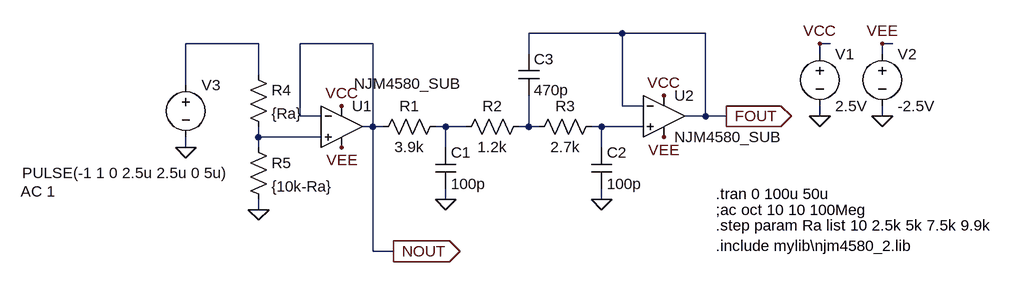
[diagram p0: schematic NJM4580 3rd VCVS with POT Buffer.asc]
NJM4580 3rd VCVS with POT Buffer.asc, the LTspice schematic file:
Version 4
SHEET 1 1076 680
WIRE 432 -64 288 -64
WIRE 560 -64 432 -64
WIRE -128 -48 -240 -48
WIRE 48 -48 -64 -48
WIRE 752 -48 736 -48
WIRE 848 -48 832 -48
WIRE 288 -32 288 -64
WIRE 736 -32 736 -48
WIRE 832 -32 832 -48
WIRE -128 0 -128 -48
WIRE -240 16 -240 -48
WIRE 432 48 432 -64
WIRE 464 48 432 48
WIRE -64 64 -64 -48
WIRE -32 64 -64 64
WIRE 560 64 560 -64
WIRE 560 64 528 64
WIRE 592 64 560 64
WIRE 736 64 736 48
WIRE 832 64 832 48
WIRE 48 80 48 -48
WIRE 48 80 32 80
WIRE 64 80 48 80
WIRE 160 80 144 80
WIRE 192 80 160 80
WIRE 288 80 288 32
WIRE 288 80 272 80
WIRE 304 80 288 80
WIRE 400 80 384 80
WIRE 464 80 400 80
WIRE -128 96 -128 80
WIRE -32 96 -128 96
WIRE -240 112 -240 96
WIRE -128 112 -128 96
WIRE 160 112 160 80
WIRE 400 112 400 80
WIRE 160 192 160 176
WIRE 400 192 400 176
WIRE -128 208 -128 192
WIRE 48 272 48 80
WIRE 80 272 48 272
FLAG 400 192 0
FLAG 160 192 0
FLAG 736 64 0
FLAG 832 64 0
FLAG 736 -48 VCC
FLAG 832 -48 VEE
FLAG 496 32 VCC
FLAG 496 96 VEE
FLAG 592 64 FOUT
IOPIN 592 64 Out
FLAG -240 112 0
FLAG -128 208 0
FLAG 0 48 VCC
FLAG 0 112 VEE
FLAG 80 272 NOUT
IOPIN 80 272 Out
SYMBOL res 160 64 R90
WINDOW 0 0 56 VBottom 2
WINDOW 3 32 56 VTop 2
SYMATTR InstName R1
SYMATTR Value 3.9k
SYMBOL res 288 64 R90
WINDOW 0 0 56 VBottom 2
WINDOW 3 32 56 VTop 2
SYMATTR InstName R2
SYMATTR Value 1.2k
SYMBOL res 400 64 R90
WINDOW 0 0 56 VBottom 2
WINDOW 3 32 56 VTop 2
SYMATTR InstName R3
SYMATTR Value 2.7k
SYMBOL cap 144 112 R0
SYMATTR InstName C1
SYMATTR Value 100p
SYMBOL cap 384 112 R0
SYMATTR InstName C2
SYMATTR Value 100p
SYMBOL cap 272 -32 R0
SYMATTR InstName C3
SYMATTR Value 470p
SYMBOL voltage 736 -48 R0
WINDOW 123 0 0 Left 2
WINDOW 39 0 0 Left 2
SYMATTR InstName V1
SYMATTR Value 2.5V
SYMBOL voltage 832 -48 R0
SYMATTR InstName V2
SYMATTR Value -2.5V
SYMBOL voltage -240 0 R0
WINDOW 3 -252 151 Left 2
WINDOW 123 -254 180 Left 2
WINDOW 39 0 0 Left 2
SYMATTR InstName V3
SYMATTR Value PULSE(-1 1 0 2.5u 2.5u 0 5u)
SYMATTR Value2 AC 1
SYMBOL res -144 -16 R0
SYMATTR InstName R4
SYMATTR Value {Ra}
SYMBOL res -144 96 R0
SYMATTR InstName R5
SYMATTR Value {10k-Ra}
SYMBOL Opamps\\opamp2 0 16 R0
WINDOW 3 19 -2 Left 2
SYMATTR InstName U1
SYMATTR Value NJM4580_SUB
SYMBOL Opamps\\opamp2 496 0 R0
SYMATTR InstName U2
SYMATTR Value NJM4580_SUB
TEXT 576 184 Left 2 !.tran 0 100u 50u
TEXT 576 208 Left 2 !;ac oct 10 10 100Meg
TEXT 576 232 Left 2 !.step param Ra list 10 2.5k 5k 7.5k 9.9k
TEXT 576 264 Left 2 !.include mylib\\njm4580_2.lib

The netlist it stands for:
* NJM4580 3rd VCVS with POT Buffer.asc
R1 N002 NOUT 3.9k
R2 N003 N002 1.2k
R3 N004 N003 2.7k
C1 N002 0 100p
C2 N004 0 100p
C3 FOUT N003 470p
V1 VCC 0 2.5V
V2 VEE 0 -2.5V
V3 N001 0 PULSE(-1 1 0 2.5u 2.5u 0 5u) AC 1
R4 N001 N005 {Ra}
R5 N005 0 {10k-Ra}
XU1 N005 NOUT VCC VEE NOUT NJM4580_SUB  ; pins In+ In- V+ V- OUT
XU2 N004 FOUT VCC VEE FOUT NJM4580_SUB  ; pins In+ In- V+ V- OUT
.tran 0 100u 50u
;ac oct 10 10 100Meg
.step param Ra list 10 2.5k 5k 7.5k 9.9k
.include mylib\njm4580_2.lib
.backanno
.end